# Altium schematic sheet power.SchDoc
size A
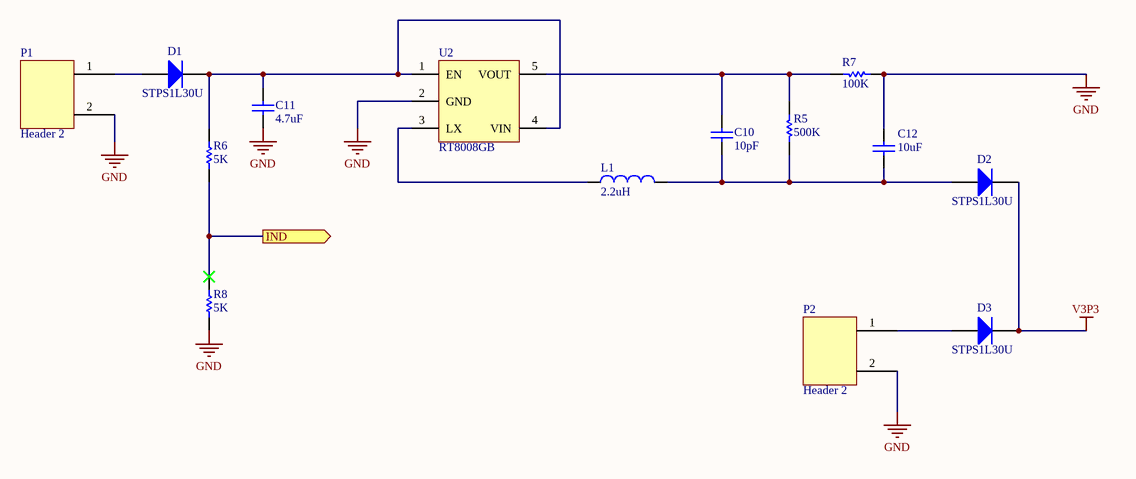
[diagram p0: power.SchDoc]

## Parts
C10  10pF  [CAPACITOR]
C11  4.7uF  [CAPACITOR]
C12  10uF  [CAPACITOR]
D1  STPS1L30U  [Schottky]
D2  STPS1L30U  [Schottky]
D3  STPS1L30U  [Schottky]
L1  2.2uH  [Inductor]
P1  Header 2  [Header 2 BATTERY]
P2  Header 2  [Header 2 BATTERY]
R5  500K  [Resistor]
R6  5K  [Resistor]
R7  100K  [Resistor]
R8  5K  [Resistor]
U2  RT8008GB  [REGULATEUR]

## Ports
IND (out)

## Nets
GND: C11.1 C12.1 P1.2 P2.2 R7.2 R8.1 U2.2(GND)
V3P3: D2.2(K) D3.2(K)
IND: R6.1 R8.2 ; port IND
NetC10_1: C10.1 R5.1 R7.1 U2.5(VOUT)
NetC10_2: C10.2 C12.2 D2.1(A) L1.2 R5.2
NetC11_2: C11.2 D1.2(K) R6.2 U2.1(EN) U2.4(VIN)
NetD1_1: D1.1(A) P1.1
NetD3_1: D3.1(A) P2.1
NetL1_1: L1.1 U2.3(LX)

## Library data of the parts
C10-C12 = Cap: Capacitor; Published: 8-Jun-2000; LatestRevisionDate: 17-Jul-2002; LatestRevisionNote: Re-released for DXP Platform.; PackageReference: RAD-0.3; Publisher: Altium Limited; PackageDescription: Radial Cap, Thru-Hole; 2 Leads; 0.3 in Pin Spacing
  C10: Value: 10pF
  C11: Value: 4.7uF
  C12: Value: 10uF
D1 = Diode: Diode Schottky; Fournisseur: Farnell; Fabricant: STMICROELECTRONICS; Ref. Fournisseur: 1467550; Published: 8-Jun-2000; LatestRevisionDate: 17-Jul-2002; LatestRevisionNote: Re-released for DXP Platform.; PackageVersion: Sep-1996; PackageReference: SMC; Publisher: Altium Limited; PackageDescription: DO-214-AB/SMC; 2 C-Bend Leads; Body 7.9 x 5.9 mm, inc. leads (LxW); Code_JEDEC: DO-214-AB; Ref. Fabricant: STPS1L30U
D2 D3 = Diode: Diode Schottky; Fabricant: STMICROELECTRONICS; Fournisseur: Farnell; Ref. Fournisseur: 1467550; Published: 8-Jun-2000; LatestRevisionDate: 17-Jul-2002; LatestRevisionNote: Re-released for DXP Platform.; PackageVersion: Sep-1996; PackageReference: SMC; Publisher: Altium Limited; PackageDescription: DO-214-AB/SMC; 2 C-Bend Leads; Body 7.9 x 5.9 mm, inc. leads (LxW); Code_JEDEC: DO-214-AB; Ref. Fabricant: STPS1L30U
L1 = Inductor: Code_IEC: 1005; Fabricant: WURTH ELEKTRONIK; Fournisseur: Farnell; Ref. Fabricant: 744772022; Ref. Fournisseur: 2211697; Published: 8-Jun-2000; LatestRevisionDate: 29-May-2009; LatestRevisionNote: IPC-7351 Footprint Added.; PackageReference: 0402-A; Publisher: Altium Limited; PackageDescription: Chip Inductor; Code_JEITA: 0402
P1 P2 = Header 2: Fabricant: MULTICOMP; Ref. Fabricant: 2211S-02G; Fournisseur: Farnell; Ref. Fournisseur: 1593411
R5-R8 = Res1: Resistor; Published: 8-Jun-2000; LatestRevisionDate: 17-Jul-2002; LatestRevisionNote: Re-released for DXP Platform.; PackageReference: AXIAL-0.3; Publisher: Altium Limited; PackageDescription: Axial Device, Thru-Hole; 2 Leads; 0.3 in Pin Spacing
U2 = RT8008GB: Voltage Regulator; Fabricant: RICHTEK; Fournisseur: Farnell; Ref. Fournisseur: 2362964; Ref. Fabricant: RT8008GB